# Altium project CW308T_SPC5676R.PrjPcb
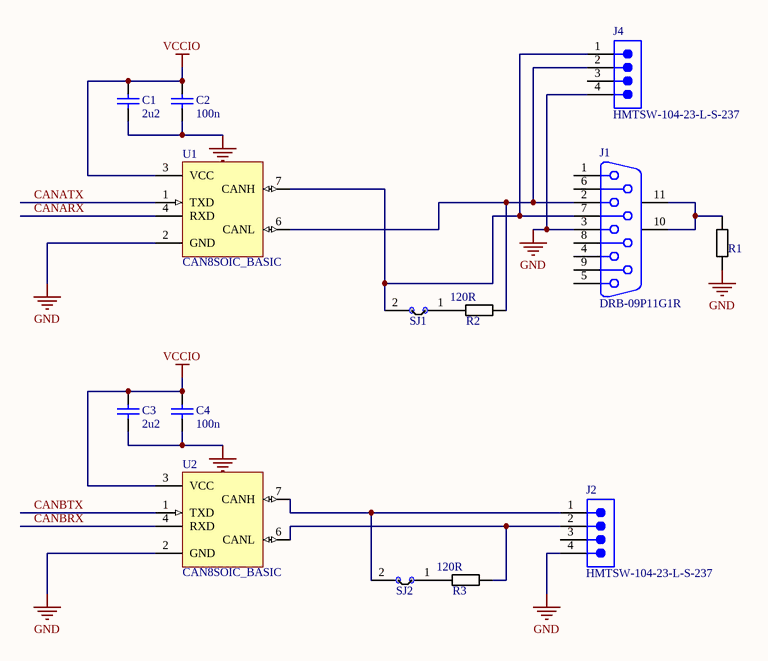
[diagram p0: mpc56_can.SchDoc]
PrjLicense: GPL; PrjName: CW308T-MPC5Y; PrjRev: 03
5 sheets, 83 parts. Net scope: global (net labels, ports and power ports of the same name join across sheets).
Board file: CW308T_SPC56.PcbDoc
Sheets:
  mpc56_can.SchDoc
  mpc56_clk.SchDoc
  mpc56_cpuio2.SchDoc
  mpc56_cwconn.SchDoc
  mpc56_mcupower.SchDoc

## Sheet mpc56_can.SchDoc: CAN Transceivers
size Letter; Organization: NewAE Technology Inc.; Address1: 1083 Queen St., Suite 196; Address2: Halifax; Address3: NS; Address4: Canada B3H 0B2; SheetNumber: 1; SheetTotal: 5; SheetApproved: YES

### Parts
C1  2u2  [CAPC0603_M]
C2  100n  [CAPC0402_M]
C3  2u2  [CAPC0603_M]
C4  100n  [CAPC0402_M]
J1  DRB-09P11G1R  [TAIT-DRB-09P11G1R_V]
J2  HMTSW-104-23-L-S-237  [SMTC-HMTSW-104-23-X-S-237]
J4  HMTSW-104-23-L-S-237  [SMTC-HMTSW-104-23-X-S-237]
R1  10R  [RESC1608X55N]  (value not drawn)
R2  120R  [RESC1608X55N]
R3  120R  [RESC1608X55N]
SJ1  NC  [SJ_2S_NC]  (value not drawn)  (no BOM)
SJ2  NC  [SJ_2S_NC]  (value not drawn)  (no BOM)
U1  CAN8SOIC_BASIC  [SOIC8_NARROW]
U2  CAN8SOIC_BASIC  [SOIC8_NARROW]

### Nets
GND: C1.2 C2.2 C3.2 C4.2 J1.3 J2.4 J4.4 R1.1 U1.2(GND) U2.2(GND)
VCCIO: C1.1 C2.1 C3.1 C4.1 U1.3(VCC) U2.3(VCC)
CANARX: U1.4(RXD)
CANATX: U1.1(TXD)
CANBRX: U2.4(RXD)
CANBTX: U2.1(TXD)
NetJ1_2: J1.2 J4.2 R2.2 U1.6(CANL)
NetJ1_7: J1.7 J4.1 SJ1.2 U1.7(CANH)
NetJ1_10: J1.10(MH1) J1.11(MH2) R1.2
NetJ2_1: J2.1 SJ2.2 U2.7(CANH)
NetJ2_2: J2.2 R3.2 U2.6(CANL)
NetR2_1: R2.1 SJ1.1
NetR3_1: R3.1 SJ2.1

Not connected (* = marked no-connect by the designer): J1 1 4 5 6 8 9; J2 3; J4 3

### Notes on the sheet
- Title:
- Date:
- Rev:
- Time:
- Project:
- Sheet
- of
- License:
- Copyright © NewAE Technology Inc.
- Approved:
- NewAE.com
- File:

### Library data of the parts
C1 C3 = CCHIP-2u2-0603: 2u2, 0603; Case-EIA: 0603; Case-Metric: 1608; Part Number: CCHIP-2u2-0603; Component Kind: Standard; Component Type: Standard; Footprint: 0603; Pin Count: 2; Value: 2u2; Mounting Technology: SMT
C2 C4 = CCHIP-100n-0402: 100n, 0402; Case-EIA: 0402; Part Number: CCHIP-100n-0402; Component Kind: Standard; Component Type: Standard; Footprint: 0402; Pin Count: 2; Value: 100n; Mounting Technology: SMT
J1 = CMP-0264-00001-1: DB9 R/A Connector, Through-hole, Male; ComponentLink1URL: http://www.taitek.com/; ComponentLink2URL: http://www.taitek.com/connects_prod_info.asp?id=A100011; PartNumber: DRB-09P11G1R; PackageDescription: 9-Pin D-Sub R/A  Male Connector, 2.77 mm Pitch; ComponentLink2Description: Datasheet; Mounting Technology: Through Hole; PackageReference: DRB-09P11G1R; ComponentLink1Description: Manufacturer URL
J2 J4 = CMP-1024-00020-1: Manufacturer: Samtec; Pitch: 2.54 mm; ComponentLink3URL: http://www.samtec.com/documents/webfiles/cpdf/HMTSW-XXX-XX-X-X-XXXX-XX-XX-MKT1.pdf; PartNumber: HMTSW-104-23-L-S-237; Temperature Range: -55 to 125 degC; ComponentLink1Description: Manufacturer URL; Orientation: Vertical; ComponentLink3Description: Package Specification; ComponentLink2URL: http://www.samtec.com/documents/webfiles/pdf/HMTSW.PDF; DatasheetVersion: F-214; PackageDescription: Assembly .025 [.64] SQ. Post Hi-Temp Terminal Strip; ComponentLink1URL: http://www.samtec.com; PackageReference: HMTSW-104-23-X-S-237; RoHS: True; Mounting Technology: Through-hole; ComponentLink2Description: Datasheet; PackageVersion: AL, 3/1987
R1 = RCHIP-10R-0603: 10R res, 0603, 1%, 1/10W; Manufacture 1: Yageo; Manufacture Part Number 1: RC0603FR-0710RL; Case-EIA: 0603; Case-Metric: 1608; Rated Power: 0.1W; Rated Voltage: 75VDC; Part Number: RCHIP-10R-0603; Component Kind: Standard; Component Type: Standard; Footprint: 0603; Pin Count: 2; Supplier 1: Digi-Key; Supplier Part Number 1: 311-10.0HRCT-ND; Value: 10R; Tolerance: 1%; Mounting Technology: SMT; Temperature Range: -55C to 155C
R2 R3 = RCHIP-120R-0603: 120R res, 0603, 1%, 1/10W; Manufacture 1: Yageo; Manufacture Part Number 1: RC0603FR-07120RL; Case-EIA: 0603; Case-Metric: 1608; Rated Power: 0.1W; Rated Voltage: 75VDC; Part Number: RCHIP-120R-0603; Component Kind: Standard; Component Type: Standard; Footprint: 0603; Pin Count: 2; Supplier 1: Digi-Key; Supplier Part Number 1: 311-120HRCT-ND; Value: 120R; Tolerance: 1%; Mounting Technology: SMT; Temperature Range: -55C to 155C
SJ1 SJ2 = SJ_2S: Solder Jumper, NC; Part Number: SJ_2S; Component Type: Standard (No BOM); Pin Count: 2
U1 U2 = SN65HVD232DR: CAN Transceiver, 3.3V; Manufacture 1: Texas Instruments; Component Group: Digital IC; Part Number: SN65HVD232DR; Footprint: SOIC8; Manufacture Part Number 1: SN65HVD232DR; Pin Count: 8; Supplier 1: Digi-Key; Supplier Part Number 1: 296-26344-1-ND; Mounting Technology: SMT; RoHS: Yes; Component Kind: Standard; Component Type: Standard

## Sheet mpc56_clk.SchDoc: Clock/Reset Drivers
size Letter; Organization: NewAE Technology Inc.; Address1: 1083 Queen St., Suite 196; Address2: Halifax; Address3: NS; Address4: Canada B3H 0B2; SheetNumber: 2; SheetTotal: 5; SheetApproved: YES
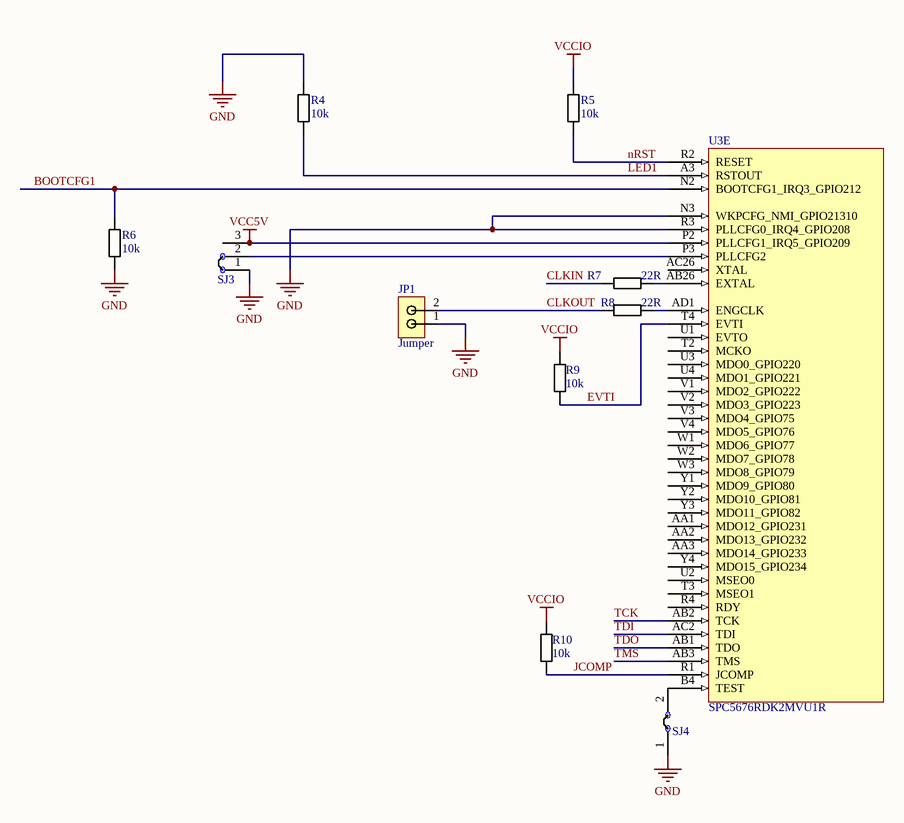
[diagram p1: mpc56_clk.SchDoc]

### Parts
JP1  Jumper  [2x2.54mm_Header]
R4  10k  [RESC1608X55N]
R5  10k  [RESC1608X55N]
R6  10k  [RESC1608X55N]
R7  22R  [RESC1608X55N]
R8  22R  [RESC1608X55N]
R9  10k  [RESC1608X55N]
R10  10k  [RESC1608X55N]
SJ3  NC  [SJ_3S_NC12]  (value not drawn)  (no BOM)
SJ4  NC  [SJ_2S_NC]  (value not drawn)  (no BOM)
U3  SPC5676RDK2MVU1R  [TEPBGA416_27x27]  (part E of 6)

### Nets
GND: JP1.1 R4.1 R6.2 SJ3.1 SJ4.1 U3.N3(WKPCFG_NMI_GPIO21310) U3.R3(PLLCFG0_IRQ4_GPIO208)
VCC5V: SJ3.3 U3.P2(PLLCFG1_IRQ5_GPIO209)
VCCIO: R5.1 R9.2 R10.1
BOOTCFG1: R6.1 U3.N2(BOOTCFG1_IRQ3_GPIO212)
CLKIN: R7.2
CLKOUT: JP1.2 R8.2
EVTI: R9.1 U3.T4(EVTI)
JCOMP: R10.2 U3.R1(JCOMP)
LED1: R4.2 U3.A3(RSTOUT)
nRST: R5.2 U3.R2(RESET)
TCK: U3.AB2(TCK)
TDI: U3.AC2(TDI)
TDO: U3.AB1(TDO)
TMS: U3.AB3(TMS)
NetR7_1: R7.1 U3.AB26(EXTAL)
NetR8_1: R8.1 U3.AD1(ENGCLK)
NetSJ3_2: SJ3.2 U3.P3(PLLCFG2)
NetSJ4_2: SJ4.2 U3.B4(TEST)

Not connected (* = marked no-connect by the designer): U3 AA1(MDO12_GPIO231) AA2(MDO13_GPIO232) AA3(MDO14_GPIO233) AC26(XTAL) R4(RDY) T2(MCKO) T3(MSEO1) U1(EVTO) U2(MSEO0) U3(MDO0_GPIO220) U4(MDO1_GPIO221) V1(MDO2_GPIO222) V2(MDO3_GPIO223) V3(MDO4_GPIO75) V4(MDO5_GPIO76) W1(MDO6_GPIO77) W2(MDO7_GPIO78) W3(MDO8_GPIO79) Y1(MDO9_GPIO80) Y2(MDO10_GPIO81) Y3(MDO11_GPIO82) Y4(MDO15_GPIO234)

### Notes on the sheet
- Title:
- Date:
- Rev:
- Time:
- Project:
- Sheet
- of
- License:
- Copyright © NewAE Technology Inc.
- Approved:
- NewAE.com
- File:

### Library data of the parts
JP1 = 2_PIN_JUMPER: 1x2 2.54mm header, male pins; Manufacture 1: Harwin; Manufacture Part Number 1: M20-9990246; Component Group: PCB Feature; PP Material Stack: 0; Part Number: 2_PIN_JUMPER; Pin Count: 2; Supplier 1: Digi-Key; Supplier Part Number 1: 952-2262-ND; Mounting Technology: Through-hole; RoHS: Yes; Component Kind: Standard; Component Type: Standard; PP Rotation: 0
R4-R6 R9 R10 = RCHIP-10K-0603: 10k res, 0603, 1%, 1/10W; Manufacture 1: Yageo; Manufacture Part Number 1: RC0603FR-0710KL; Case-EIA: 0603; Case-Metric: 1608; Rated Power: 0.1W; Rated Voltage: 75VDC; Part Number: RCHIP-10K-0603; Component Kind: Standard; Component Type: Standard; Footprint: 0603; Pin Count: 2; Supplier 1: Digi-Key; Supplier Part Number 1: 311-10.0KHRCT-ND; Value: 10k; Tolerance: 1%; Mounting Technology: SMT; Temperature Range: -55C to 155C
R7 R8 = RCHIP-22R-0603: 22R res, 0603, 1%, 1/10W; Manufacture 1: Yageo; Manufacture Part Number 1: RC0603FR-0722RL; Case-EIA: 0603; Case-Metric: 1608; Rated Power: 0.1W; Rated Voltage: 75VDC; Part Number: RCHIP-22R-0603; Component Kind: Standard; Component Type: Standard; Footprint: 0603; Pin Count: 2; Supplier 1: Digi-Key; Supplier Part Number 1: 311-22.0HRCT-ND; Value: 22R; Tolerance: 1%; Mounting Technology: SMT; Temperature Range: -55C to 155C
SJ3 = SJ_3S_12JMP: Solder Jumper, NC; Component Group: PCB Feature; Part Number: SJ_3S_12JMP; Pin Count: 3; Mounting Technology: COPPER; Component Type: Standard (No BOM)
SJ4 = SJ_2S: Solder Jumper, NC; Part Number: SJ_2S; Component Type: Standard (No BOM); Pin Count: 2
U3 = SPC5676RDK2MVU1R: Dual-Core PPC, Automotive; Manufacture 1: NXP; Component Group: Digital IC; PP Material Stack: 0; Part Number: SPC5676RDK2MVU1R; Manufacture Part Number 1: SPC5676RDK2MVU1R; Pin Count: 412; Supplier 1: Mouser; Mounting Technology: SMT; RoHS: Yes; Component Kind: Standard; Component Type: Standard; PP Rotation: 0

## Sheet mpc56_cpuio2.SchDoc: CPU I/O Bank 2
size Letter; Organization: NewAE Technology Inc.; Address1: 1083 Queen St., Suite 196; Address2: Halifax; Address3: NS; Address4: Canada B3H 0B2; SheetNumber: 3; SheetTotal: 5; SheetApproved: NO
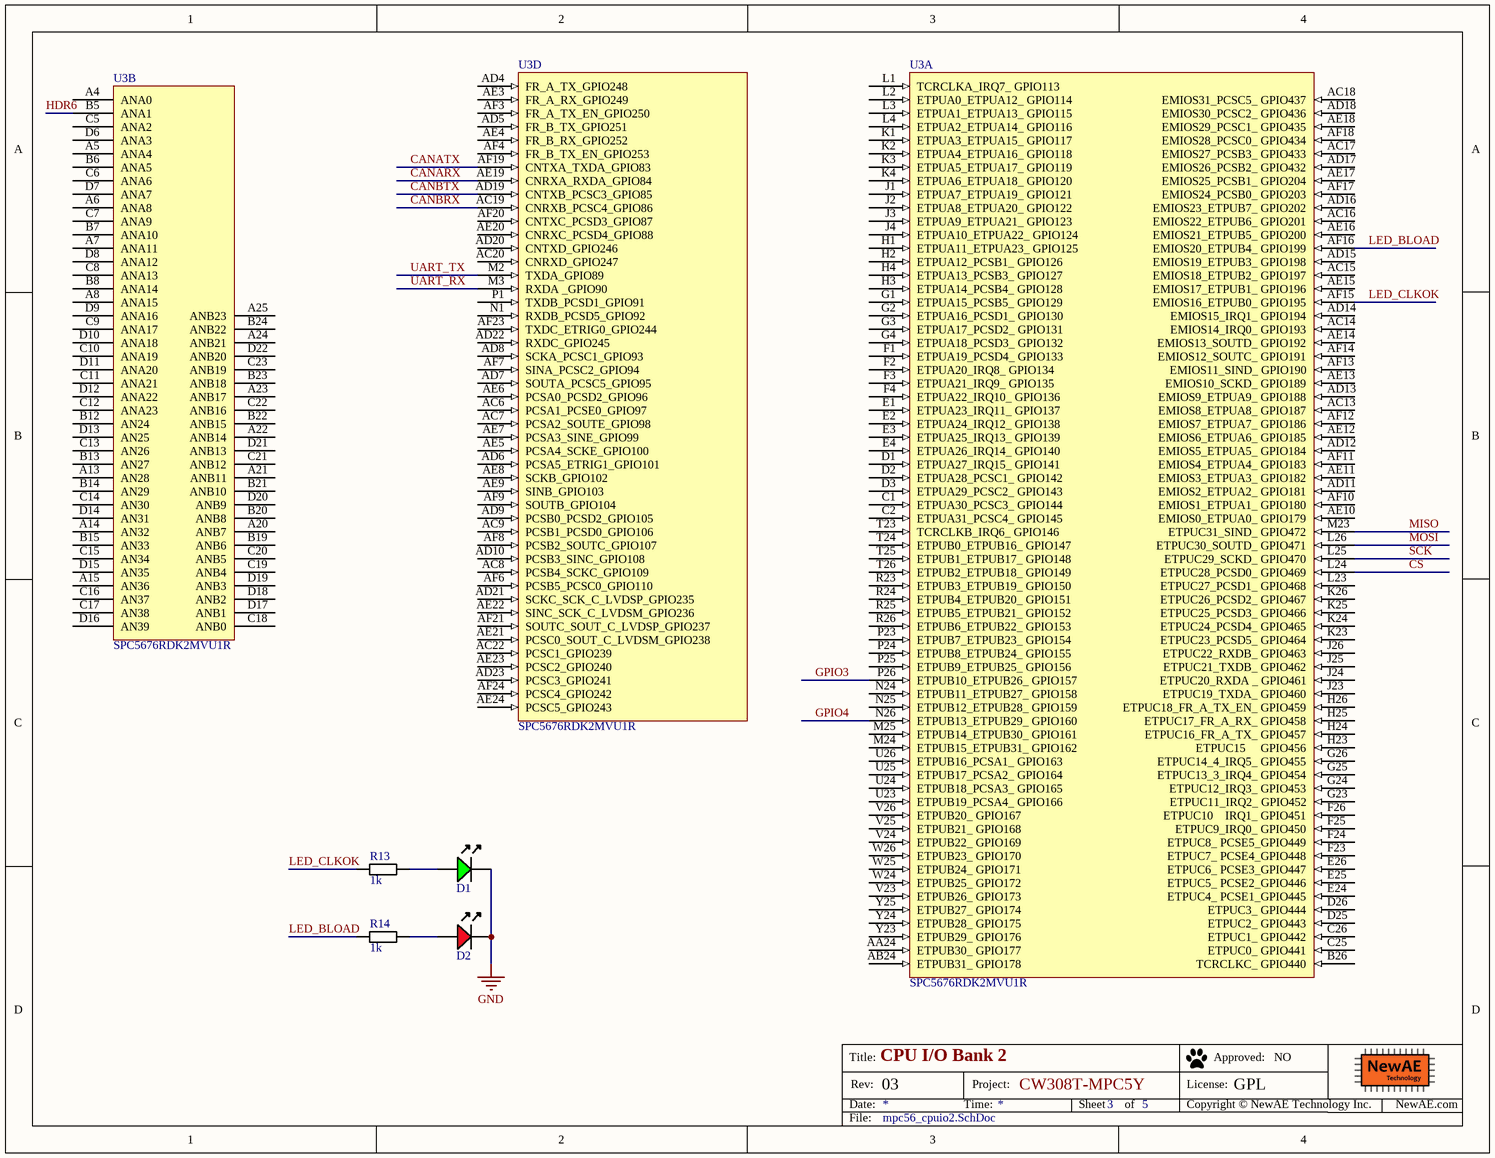
[diagram p2: mpc56_cpuio2.SchDoc]

### Parts
D1  LED, 0603, Green  [LED-0603-GREEN]  (value not drawn)
D2  LED, 0603, Red  [LED-0603-RED]  (value not drawn)
R13  1k  [RESC1608X55N]
R14  1k  [RESC1608X55N]
U3  SPC5676RDK2MVU1R  [TEPBGA416_27x27]  (parts A,B,D of 6)

### Nets
GND: D1.K D2.K
VCCIO: U3.AF4(FR_B_TX_EN_GPIO253)
CANARX: U3.AE19(CNRXA_RXDA_GPIO84)
CANATX: U3.AF19(CNTXA_TXDA_GPIO83)
CANBRX: U3.AC19(CNRXB_PCSC4_GPIO86)
CANBTX: U3.AD19(CNTXB_PCSC3_GPIO85)
CS: U3.L24(ETPUC28_PCSD0__GPIO469)
GPIO3: U3.P26(ETPUB10_ETPUB26__GPIO157)
GPIO4: U3.N26(ETPUB13_ETPUB29__GPIO160)
HDR6: U3.B5(ANA1)
LED_BLOAD: R14.1 U3.AF16(EMIOS20_ETPUB4__GPIO199)
LED_CLKOK: R13.1 U3.AF15(EMIOS16_ETPUB0__GPIO195)
MISO: U3.M23(ETPUC31_SIND__GPIO472)
MOSI: U3.L26(ETPUC30_SOUTD__GPIO471)
SCK: U3.L25(ETPUC29_SCKD__GPIO470)
UART_RX: U3.M3(RXDA__GPIO90)
UART_TX: U3.M2(TXDA_GPIO89)
NetD1_A: D1.A R13.2
NetD2_A: D2.A R14.2

Not connected (* = marked no-connect by the designer): U3 A4(ANA0) A5(ANA4) A6(ANA8) A7(ANA11) A8(ANA15) A13(AN28) A14(AN32) A15(AN36) A20(ANB7) A21(ANB11) A22(ANB14) A23(ANB17) A24(ANB21) A25(ANB23) AA24(ETPUB30__GPIO177) AB24(ETPUB31__GPIO178) AC6(PCSA1_PCSE0_GPIO97) AC7(PCSA2_SOUTE_GPIO98) AC8(PCSB4_SCKC_GPIO109) AC9(PCSB1_PCSD0_GPIO106) AC13(EMIOS8_ETPUA8__GPIO187) AC14(EMIOS14_IRQ0__GPIO193) AC15(EMIOS18_ETPUB2__GPIO197) AC16(EMIOS22_ETPUB6__GPIO201) AC17(EMIOS27_PCSB3__GPIO433) AC18(EMIOS31_PCSC5__GPIO437) AC20(CNRXD_GPIO247) AC22(PCSC1_GPIO239) AD4(FR_A_TX_GPIO248) AD5(FR_B_TX_GPIO251) AD6(PCSA5_ETRIG1_GPIO101) AD7(SOUTA_PCSC5_GPIO95) AD8(SCKA_PCSC1_GPIO93) AD9(PCSB0_PCSD2_GPIO105) AD10(PCSB3_SINC_GPIO108) AD11(EMIOS2_ETPUA2__GPIO181) AD12(EMIOS5_ETPUA5__GPIO184) AD13(EMIOS9_ETPUA9__GPIO188) AD14(EMIOS15_IRQ1__GPIO194) AD15(EMIOS19_ETPUB3__GPIO198) AD16(EMIOS23_ETPUB7__GPIO202) AD17(EMIOS26_PCSB2__GPIO432) AD18(EMIOS30_PCSC2__GPIO436) AD20(CNTXD_GPIO246) AD21(SCKC_SCK_C_LVDSP_GPIO235) AD22(RXDC_GPIO245) AD23(PCSC3_GPIO241) AE3(FR_A_RX_GPIO249) AE4(FR_B_RX_GPIO252) AE5(PCSA4_SCKE_GPIO100) AE6(PCSA0_PCSD2_GPIO96) AE7(PCSA3_SINE_GPIO99) AE8(SCKB_GPIO102) AE9(SINB_GPIO103) AE10(EMIOS0_ETPUA0__GPIO179) AE11(EMIOS3_ETPUA3__GPIO182) AE12(EMIOS6_ETPUA6__GPIO185) AE13(EMIOS10_SCKD__GPIO189) AE14(EMIOS13_SOUTD__GPIO192) AE15(EMIOS17_ETPUB1__GPIO196) AE16(EMIOS21_ETPUB5__GPIO200) AE17(EMIOS25_PCSB1__GPIO204) AE18(EMIOS29_PCSC1__GPIO435) AE20(CNRXC_PCSD4_GPIO88) AE21(PCSC0_SOUT_C_LVDSM_GPIO238) AE22(SINC_SCK_C_LVDSM_GPIO236) AE23(PCSC2_GPIO240) AE24(PCSC5_GPIO243) AF3(FR_A_TX_EN_GPIO250) AF6(PCSB5_PCSC0_GPIO110) AF7(SINA_PCSC2_GPIO94) AF8(PCSB2_SOUTC_GPIO107) AF9(SOUTB_GPIO104) AF10(EMIOS1_ETPUA1__GPIO180) AF11(EMIOS4_ETPUA4__GPIO183) AF12(EMIOS7_ETPUA7__GPIO186) AF13(EMIOS11_SIND__GPIO190) AF14(EMIOS12_SOUTC__GPIO191) AF17(EMIOS24_PCSB0__GPIO203) AF18(EMIOS28_PCSC0__GPIO434) AF20(CNTXC_PCSD3_GPIO87) AF21(SOUTC_SOUT_C_LVDSP_GPIO237) AF23(TXDC_ETRIG0_GPIO244) AF24(PCSC4_GPIO242) B6(ANA5) B7(ANA10) B8(ANA14) B12(AN24) B13(AN27) B14(AN29) B15(AN33) B19(ANB6) B20(ANB8) B21(ANB10) B22(ANB15) B23(ANB18) B24(ANB22) B26(TCRCLKC__GPIO440) C1(ETPUA30_PCSC3__GPIO144) C2(ETPUA31_PCSC4__GPIO145) C5(ANA2) C6(ANA6) C7(ANA9) C8(ANA13) C9(ANA17) C10(ANA19) C11(ANA21) C12(ANA23) C13(AN26) C14(AN30) C15(AN34) C16(AN37) C17(AN38) C18(ANB0) C19(ANB4) C20(ANB5) C21(ANB12) C22(ANB16) C23(ANB19) C25(ETPUC0__GPIO441) C26(ETPUC1__GPIO442) D1(ETPUA27_IRQ15__GPIO141) D2(ETPUA28_PCSC1__GPIO142) D3(ETPUA29_PCSC2__GPIO143) D6(ANA3) D7(ANA7) D8(ANA12) D9(ANA16) D10(ANA18) D11(ANA20) D12(ANA22) D13(AN25) D14(AN31) D15(AN35) D16(AN39) D17(ANB1) D18(ANB2) D19(ANB3) D20(ANB9) D21(ANB13) D22(ANB20) D25(ETPUC2__GPIO443) D26(ETPUC3__GPIO444) E1(ETPUA23_IRQ11__GPIO137) E2(ETPUA24_IRQ12__GPIO138) E3(ETPUA25_IRQ13__GPIO139) E4(ETPUA26_IRQ14__GPIO140) E24(ETPUC4__PCSE1_GPIO445) E25(ETPUC5__PCSE2_GPIO446) E26(ETPUC6__PCSE3_GPIO447) F1(ETPUA19_PCSD4__GPIO133) F2(ETPUA20_IRQ8__GPIO134) F3(ETPUA21_IRQ9__GPIO135) F4(ETPUA22_IRQ10__GPIO136) F23(ETPUC7__PCSE4_GPIO448) F24(ETPUC8__PCSE5_GPIO449) F25(ETPUC9_IRQ0__GPIO450) F26(ETPUC10    IRQ1__GPIO451) G1(ETPUA15_PCSB5__GPIO129) G2(ETPUA16_PCSD1__GPIO130) G3(ETPUA17_PCSD2__GPIO131) G4(ETPUA18_PCSD3__GPIO132) G23(ETPUC11_IRQ2__GPIO452) G24(ETPUC12_IRQ3__GPIO453) G25(ETPUC13_3_IRQ4__GPIO454) G26(ETPUC14_4_IRQ5__GPIO455) H1(ETPUA11_ETPUA23__GPIO125) H2(ETPUA12_PCSB1__GPIO126) H3(ETPUA14_PCSB4__GPIO128) H4(ETPUA13_PCSB3__GPIO127) H23(ETPUC15    _GPIO456) H24(ETPUC16_FR_A_TX__GPIO457) H25(ETPUC17_FR_A_RX__GPIO458) H26(ETPUC18_FR_A_TX_EN__GPIO459) J1(ETPUA7_ETPUA19__GPIO121) J2(ETPUA8_ETPUA20__GPIO122) J3(ETPUA9_ETPUA21__GPIO123) J4(ETPUA10_ETPUA22__GPIO124) J23(ETPUC19_TXDA__GPIO460) J24(ETPUC20_RXDA___GPIO461) J25(ETPUC21_TXDB__GPIO462) J26(ETPUC22_RXDB__GPIO463) K1(ETPUA3_ETPUA15__GPIO117) K2(ETPUA4_ETPUA16__GPIO118) K3(ETPUA5_ETPUA17__GPIO119) K4(ETPUA6_ETPUA18__GPIO120) K23(ETPUC23_PCSD5__GPIO464) K24(ETPUC24_PCSD4__GPIO465) K25(ETPUC25_PCSD3__GPIO466) K26(ETPUC26_PCSD2__GPIO467) L1(TCRCLKA_IRQ7__GPIO113) L2(ETPUA0_ETPUA12__GPIO114) L3(ETPUA1_ETPUA13__GPIO115) L4(ETPUA2_ETPUA14__GPIO116) L23(ETPUC27_PCSD1__GPIO468) M24(ETPUB15_ETPUB31__GPIO162) M25(ETPUB14_ETPUB30__GPIO161) N1(RXDB_PCSD5_GPIO92) N24(ETPUB11_ETPUB27__GPIO158) N25(ETPUB12_ETPUB28__GPIO159) P1(TXDB_PCSD1_GPIO91) P23(ETPUB7_ETPUB23__GPIO154) P24(ETPUB8_ETPUB24__GPIO155) P25(ETPUB9_ETPUB25__GPIO156) R23(ETPUB3_ETPUB19__GPIO150) R24(ETPUB4_ETPUB20__GPIO151) R25(ETPUB5_ETPUB21__GPIO152) R26(ETPUB6_ETPUB22__GPIO153) T23(TCRCLKB_IRQ6__GPIO146) T24(ETPUB0_ETPUB16__GPIO147) T25(ETPUB1_ETPUB17__GPIO148) T26(ETPUB2_ETPUB18__GPIO149) U23(ETPUB19_PCSA4__GPIO166) U24(ETPUB18_PCSA3__GPIO165) U25(ETPUB17_PCSA2__GPIO164) U26(ETPUB16_PCSA1__GPIO163) V23(ETPUB26__GPIO173) V24(ETPUB22__GPIO169) V25(ETPUB21__GPIO168) V26(ETPUB20__GPIO167) W24(ETPUB25__GPIO172) W25(ETPUB24__GPIO171) W26(ETPUB23__GPIO170) Y23(ETPUB29__GPIO176) Y24(ETPUB28__GPIO175) Y25(ETPUB27__GPIO174)

### Notes on the sheet
- Title:
- Date:
- Rev:
- Time:
- Project:
- Sheet
- of
- License:
- Copyright © NewAE Technology Inc.
- Approved:
- NewAE.com
- File:

### Library data of the parts
D1 = LEDCHIP_0603_GREEN: Chip LED, Green; Part Number: LEDCHIP_0603_GREEN; Component Kind: Standard; Component Type: Standard; Pin Count: 2; Mounting Technology: SMT
D2 = LEDCHIP_0603_RED: Chip LED, Red; Part Number: LEDCHIP_0603_RED; Component Kind: Standard; Component Type: Standard; Pin Count: 2; Mounting Technology: SMT
R13 R14 = RCHIP-1K-0603: 1k res, 0603, 1%, 1/10W; Manufacture 1: Yageo; Manufacture Part Number 1: RC0603FR-071KL; Case-EIA: 0603; Case-Metric: 1608; Rated Power: 0.1W; Rated Voltage: 75VDC; Part Number: RCHIP-1K-0603; Component Kind: Standard; Component Type: Standard; Footprint: 0603; Pin Count: 2; Supplier 1: Digi-Key; Supplier Part Number 1: 311-1.00KHRCT-ND; Value: 1k; Tolerance: 1%; Mounting Technology: SMT; Temperature Range: -55C to 155C
U3 = SPC5676RDK2MVU1R: as U3 on sheet mpc56_clk; Part Number: SPC5676RDK2MVU1R; Manufacture Part Number 1: SPC5676RDK2MVU1R; Pin Count: 412; Supplier 1: Mouser; Mounting Technology: SMT; RoHS: Yes; Component Kind: Standard; Component Type: Standard; PP Rotation: 0

## Sheet mpc56_cwconn.SchDoc: CW308 UFO Connectors
size Letter; Organization: NewAE Technology Inc.; Address1: 1083 Queen St., Suite 196; Address2: Halifax; Address3: NS; Address4: Canada B3H 0B2; SheetNumber: 4; SheetTotal: 5; SheetApproved: YES
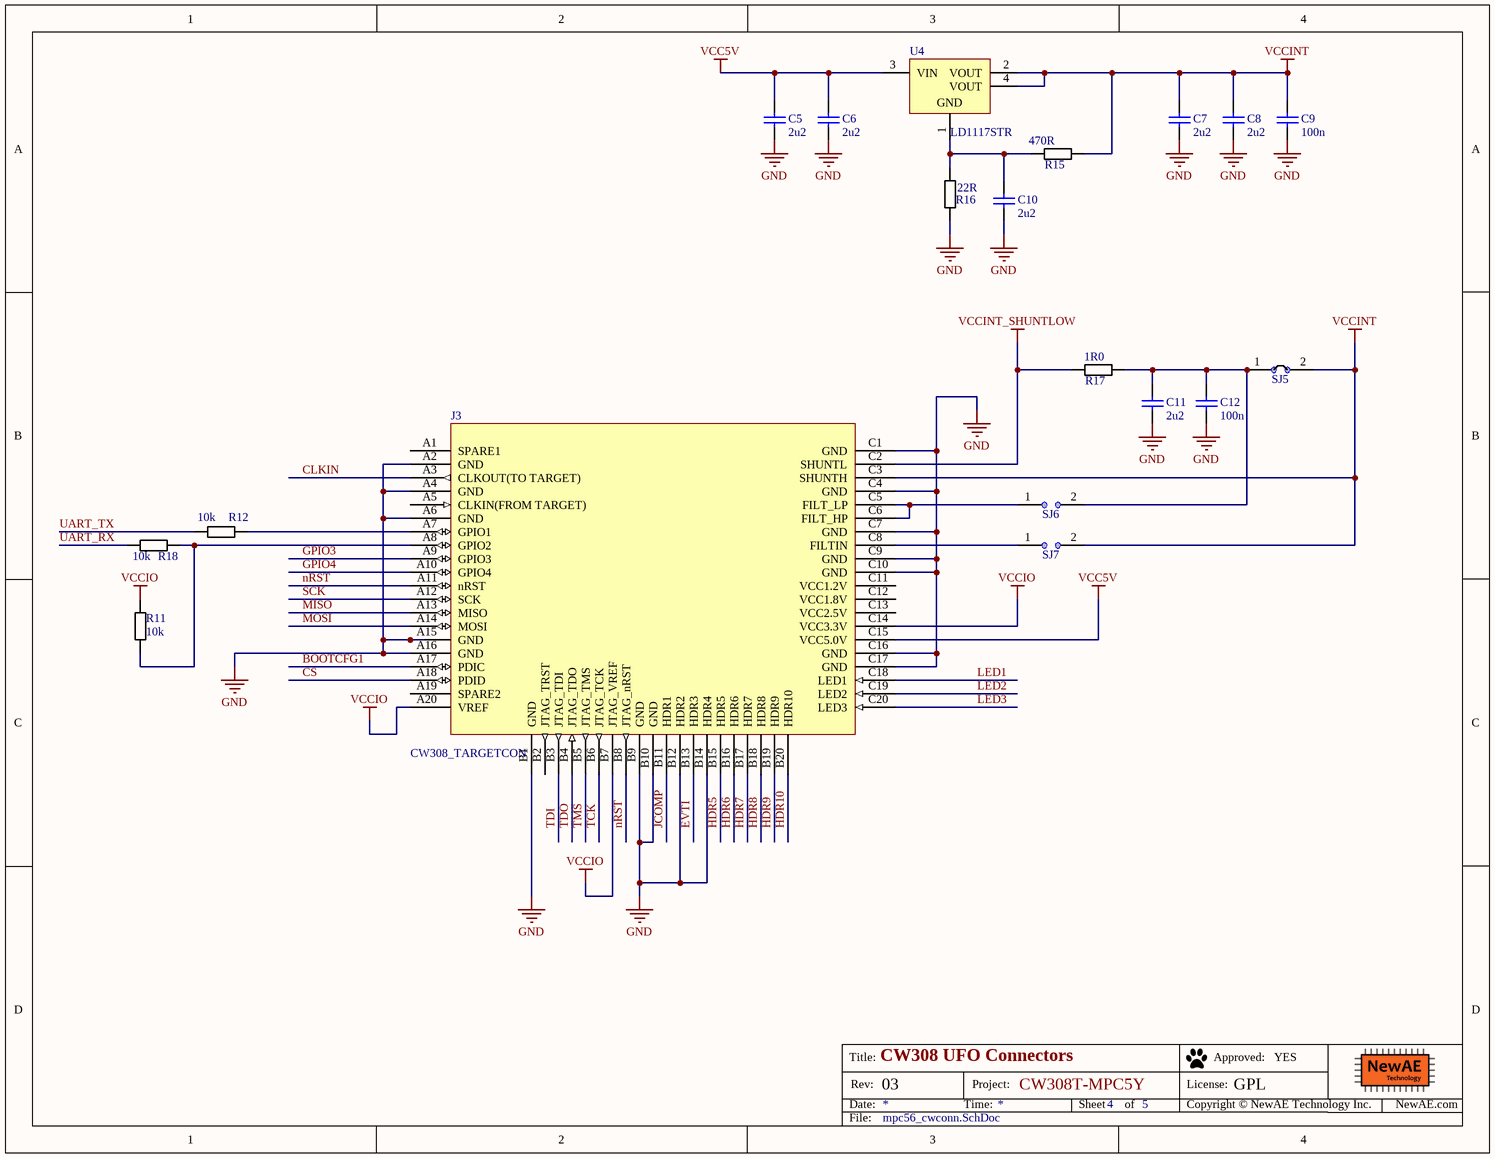
[diagram p3: mpc56_cwconn.SchDoc]

### Parts
C5  2u2  [CAPC0603_M]
C6  2u2  [CAPC0603_M]
C7  2u2  [CAPC0603_M]
C8  2u2  [CAPC0603_M]
C9  100n  [CAPC0402_M]
C10  2u2  [CAPC0603_M]
C11  2u2  [CAPC0603_M]
C12  100n  [CAPC0402_M]
J3  CW308_TARGETCON  [CW308_TBOARD_CONN]
R11  10k  [RESC1608X55N]
R12  10k  [RESC1608X55N]
R15  470R  [RESC1608X55N]
R16  22R  [RESC1608X55N]
R17  1R0  [RESC2012X70N]
R18  10k  [RESC1608X55N]
SJ5  NC  [SJ_2S_NC]  (value not drawn)  (no BOM)
SJ6  NO  [SJ_2S_NO]  (value not drawn)  (no BOM)
SJ7  NO  [SJ_2S_NO]  (value not drawn)  (no BOM)
U4  LD1117STR  [SOT-223_L]

### Nets
GND: C5.2 C6.2 C7.2 C8.2 C9.2 C10.2 C11.2 C12.2 J3.A2(GND) J3.A4(GND) J3.A6(GND) J3.A15(GND) J3.A16(GND) J3.B1(GND) J3.B9(GND) J3.B10(GND) J3.B12(HDR2) J3.B14(HDR4) J3.C1(GND) J3.C4(GND) J3.C7(GND) J3.C9(GND) J3.C10(GND) J3.C16(GND) J3.C17(GND) R16.2
VCC5V: C5.1 C6.1 J3.C15(VCC5.0V) U4.3(VIN)
VCCINT: C7.1 C8.1 C9.1 J3.C3(SHUNTH) R15.1 SJ5.2 SJ7.2 U4.2(VOUT) U4.4(VOUT)
VCCINT_SHUNTLOW: J3.C2(SHUNTL) R17.1
VCCIO: J3.A20(VREF) J3.B7(JTAG_VREF) J3.C14(VCC3.3V) R11.2
BOOTCFG1: J3.A17(PDIC)
CLKIN: J3.A3(CLKOUT(TO_TARGET))
CS: J3.A18(PDID)
EVTI: J3.B13(HDR3)
GPIO3: J3.A9(GPIO3)
GPIO4: J3.A10(GPIO4)
HDR5: J3.B15(HDR5)
HDR6: J3.B16(HDR6)
HDR7: J3.B17(HDR7)
HDR8: J3.B18(HDR8)
HDR9: J3.B19(HDR9)
HDR10: J3.B20(HDR10)
JCOMP: J3.B11(HDR1)
LED1: J3.C18(LED1)
LED2: J3.C19(LED2)
LED3: J3.C20(LED3)
MISO: J3.A13(MISO)
MOSI: J3.A14(MOSI)
nRST: J3.A11(nRST) J3.B8(JTAG_nRST)
SCK: J3.A12(SCK)
TCK: J3.B6(JTAG_TCK)
TDI: J3.B3(JTAG_TDI)
TDO: J3.B4(JTAG_TDO)
TMS: J3.B5(JTAG_TMS)
UART_RX: R18.1
UART_TX: R12.1
NetC10_1: C10.1 R15.2 R16.1 U4.1(GND)
NetC11_1: C11.1 C12.1 R17.2 SJ5.1 SJ6.2
NetJ3_A7: J3.A7(GPIO1) R12.2
NetJ3_A8: J3.A8(GPIO2) R11.1 R18.2
NetJ3_C5: J3.C5(FILT_LP) J3.C6(FILT_HP) SJ6.1
NetJ3_C8: J3.C8(FILTIN) SJ7.1

Not connected (* = marked no-connect by the designer): J3 A1(SPARE1) A5(CLKIN(FROM_TARGET)) A19(SPARE2) B2(JTAG_TRST) C11(VCC1.2V) C12(VCC1.8V) C13(VCC2.5V)

### Notes on the sheet
- Title:
- Date:
- Rev:
- Time:
- Project:
- Sheet
- of
- License:
- Copyright © NewAE Technology Inc.
- Approved:
- NewAE.com
- File:

### Library data of the parts
C5-C8 C10 C11 = CCHIP-2u2-0603: as C1 on sheet mpc56_can; Part Number: CCHIP-2u2-0603; Component Kind: Standard; Component Type: Standard; Footprint: 0603; Pin Count: 2; Value: 2u2; Mounting Technology: SMT
C9 C12 = CCHIP-100n-0402: 100n, 0402; Case-EIA: 0402; Part Number: CCHIP-100n-0402; Component Kind: Standard; Component Type: Standard; Footprint: 0402; Pin Count: 2; Value: 100n; Mounting Technology: SMT
J3 = CW308_TBOARD: CW308 "Standard" Target Board Connector
R11 R12 R18 = RCHIP-10K-0603: as R4 on sheet mpc56_clk; Part Number: RCHIP-10K-0603; Component Kind: Standard; Component Type: Standard; Footprint: 0603; Pin Count: 2; Supplier 1: Digi-Key; Supplier Part Number 1: 311-10.0KHRCT-ND; Value: 10k; Tolerance: 1%; Mounting Technology: SMT; Temperature Range: -55C to 155C
R15 = RCHIP-120R-0603: 470R res, 0603, 1%, 1/10W; Manufacture 1: Yageo; Manufacture Part Number 1: RC0603FR-07470RL; Case-EIA: 0603; Case-Metric: 1608; Rated Power: 0.1W; Rated Voltage: 75VDC; Part Number: RCHIP-120R-0603; Component Kind: Standard; Component Type: Standard; Footprint: 0603; Pin Count: 2; Supplier 1: Digi-Key; Supplier Part Number 1: 311-470HRCT-ND; Value: 470R; Tolerance: 1%; Mounting Technology: SMT; Temperature Range: -55C to 155C
R16 = RCHIP-120R-0603: 120R res, 0603, 1%, 1/10W; Manufacture 1: Yageo; Manufacture Part Number 1: RC0603FR-0722RL; Case-EIA: 0603; Case-Metric: 1608; Rated Power: 0.1W; Rated Voltage: 75VDC; Part Number: RCHIP-120R-0603; Component Kind: Standard; Component Type: Standard; Footprint: 0603; Pin Count: 2; Supplier 1: Digi-Key; Supplier Part Number 1: 311-22HRCT-ND; Value: 22R; Tolerance: 1%; Mounting Technology: SMT; Temperature Range: -55C to 155C
R17 = RCHIP-1R0-0805: 1R0 res, 0805, 1%, 1/8W; Manufacture 1: Yageo; Manufacture Part Number 1: RC0805FR-071RL; Case-EIA: 0805; Rated Power: 0.125W; Rated Voltage: 75VDC; Part Number: RCHIP-1R0-0805; Component Kind: Standard; Component Type: Standard; Footprint: 0805; Pin Count: 2; Supplier 1: Digi-Key; Supplier Part Number 1: 311-1.00CRCT-ND; Value: 1R0; Tolerance: 1%; Mounting Technology: SMT; Temperature Range: -55C to 155C
SJ5 = SJ_2S: Solder Jumper, NC; Part Number: SJ_2S; Component Type: Standard (No BOM); Pin Count: 2
SJ6 SJ7 = SJ_2S_NO: Solder Jumper, NO; Part Number: SJ_2S_NO; Component Type: Standard (No BOM); Pin Count: 2; Mounting Technology: COPPER
U4 = CMP-0244-00313-1: Adjustable Low Drop Voltage Regulator, 1.25 to 15V, 4-Pin SOT-223, Tape and Reel; ComponentLink2Description: Datasheet; PackageVersion: 2010; PackageReference: SOT-223; ComponentLink2URL: http://www.st.com/internet/com/TECHNICAL_RESOURCES/TECHNICAL_LITERATURE/DATASHEET/CD00000544.pdf; DatasheetVersion: 1/11/2011; ComponentLink1URL: http://www.st.com; PackageDescription: 4-Pin SOT-223 Package, 6.5 x 3.5 mm Body, 2.3 mm Pitch, 7 mm Lead Span; ComponentLink1Description: Manufacturer URL; Supplier 1: Digi-Key; Supplier Part Number 1: 497-1244-1-ND

## Sheet mpc56_mcupower.SchDoc: MCU Power
size Letter; Organization: NewAE Technology Inc.; Address1: 1083 Queen St., Suite 196; Address2: Halifax; Address3: NS; Address4: Canada B3H 0B2; SheetNumber: 5; SheetTotal: 5; SheetApproved: YES
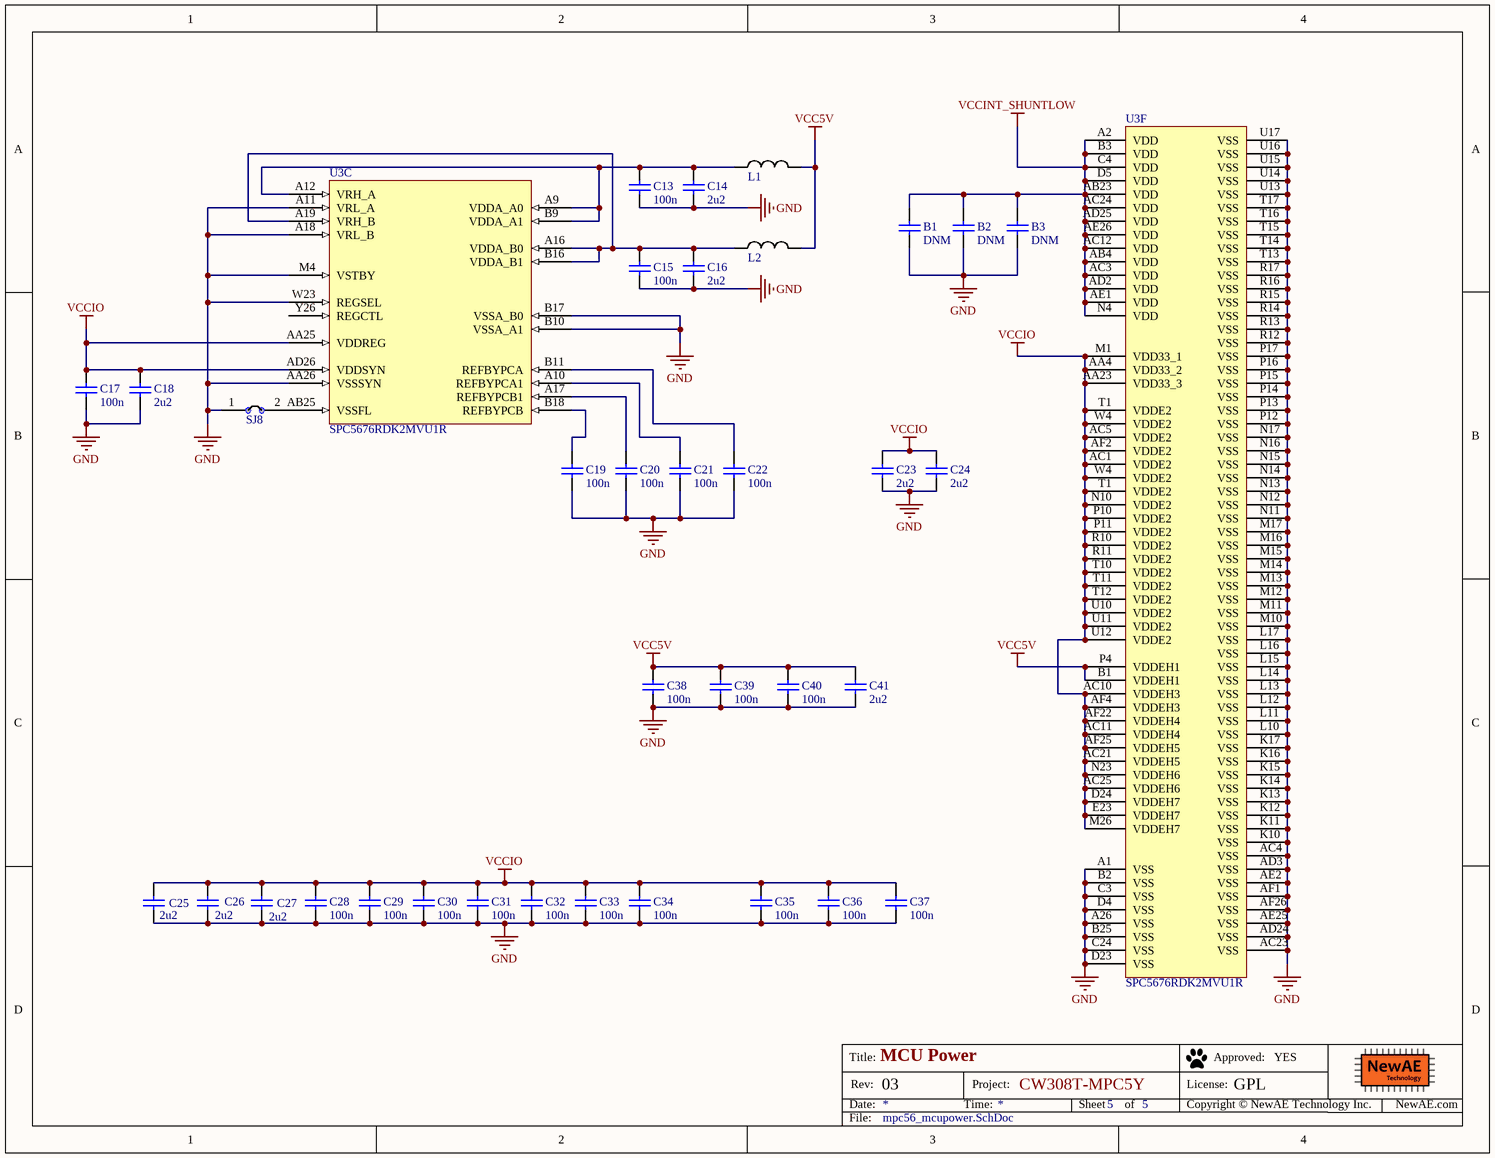
[diagram p4: mpc56_mcupower.SchDoc]

### Parts
B1  DNM  [CAPC0402_M]
B2  DNM  [CAPC0402_M]
B3  DNM  [CAPC0402_M]
C13  100n  [CAPC0402_M]
C14  2u2  [CAPC0603_M]
C15  100n  [CAPC0402_M]
C16  2u2  [CAPC0603_M]
C17  100n  [CAPC0402_M]
C18  2u2  [CAPC0603_M]
C19  100n  [CAPC0402_M]
C20  100n  [CAPC0402_M]
C21  100n  [CAPC0402_M]
C22  100n  [CAPC0402_M]
C23  2u2  [CAPC0603_M]
C24  2u2  [CAPC0603_M]
C25  2u2  [CAPC0603_M]
C26  2u2  [CAPC0603_M]
C27  2u2  [CAPC0603_M]
C28  100n  [CAPC0402_M]
C29  100n  [CAPC0402_M]
C30  100n  [CAPC0402_M]
C31  100n  [CAPC0402_M]
C32  100n  [CAPC0402_M]
C33  100n  [CAPC0402_M]
C34  100n  [CAPC0402_M]
C35  100n  [CAPC0402_M]
C36  100n  [CAPC0402_M]
C37  100n  [CAPC0402_M]
C38  100n  [CAPC0402_M]
C39  100n  [CAPC0402_M]
C40  100n  [CAPC0402_M]
C41  2u2  [CAPC0603_M]
L1  1k @ 1Mhz  [IND_0603]  (value not drawn)
L2  1k @ 1Mhz  [IND_0603]  (value not drawn)
SJ8  NC  [SJ_2S_NC]  (value not drawn)  (no BOM)
U3  SPC5676RDK2MVU1R  [TEPBGA416_27x27]  (parts C,F of 6)

### Nets
GND: B1.2 B2.2 B3.2 C13.2 C14.2 C15.2 C16.2 C17.2 C18.2 C19.2 C20.2 C21.2 C22.2 C23.2 C24.2 C25.2 C26.2 C27.2 C28.2 C29.2 C30.2 C31.2 C32.2 C33.2 C34.2 C35.2 C36.2 C37.2 C38.2 C39.2 C40.2 C41.2 SJ8.1 U3.A1(VSS) U3.A11(VRL_A) U3.A18(VRL_B) U3.A26(VSS) U3.AA26(VSSSYN) U3.AC4(VSS) U3.AC23(VSS) U3.AD3(VSS) U3.AD24(VSS) U3.AE2(VSS) U3.AE25(VSS) U3.AF1(VSS) U3.AF26(VSS) U3.B2(VSS) U3.B10(VSSA_A1) U3.B17(VSSA_B0) U3.B25(VSS) U3.C3(VSS) U3.C24(VSS) U3.D4(VSS) U3.D23(VSS) U3.K10(VSS) U3.K11(VSS) U3.K12(VSS) U3.K13(VSS) U3.K14(VSS) U3.K15(VSS) U3.K16(VSS) U3.K17(VSS) U3.L10(VSS) U3.L11(VSS) U3.L12(VSS) U3.L13(VSS) U3.L14(VSS) U3.L15(VSS) U3.L16(VSS) U3.L17(VSS) U3.M4(VSTBY) U3.M10(VSS) U3.M11(VSS) U3.M12(VSS) U3.M13(VSS) U3.M14(VSS) U3.M15(VSS) U3.M16(VSS) U3.M17(VSS) U3.N11(VSS) U3.N12(VSS) U3.N13(VSS) U3.N14(VSS) U3.N15(VSS) U3.N16(VSS) U3.N17(VSS) U3.P12(VSS) U3.P13(VSS) U3.P14(VSS) U3.P15(VSS) U3.P16(VSS) U3.P17(VSS) U3.R12(VSS) U3.R13(VSS) U3.R14(VSS) U3.R15(VSS) U3.R16(VSS) U3.R17(VSS) U3.T13(VSS) U3.T14(VSS) U3.T15(VSS) U3.T16(VSS) U3.T17(VSS) U3.U13(VSS) U3.U14(VSS) U3.U15(VSS) U3.U16(VSS) U3.U17(VSS) U3.W23(REGSEL)
VCC5V: C38.1 C39.1 C40.1 C41.1 L1.2 L2.2 U3.B1(VDDEH1) U3.P4(VDDEH1)
VCCINT_SHUNTLOW: B1.1 B2.1 B3.1 U3.A2(VDD) U3.AB4(VDD) U3.AB23(VDD) U3.AC3(VDD) U3.AC12(VDD) U3.AC24(VDD) U3.AD2(VDD) U3.AD25(VDD) U3.AE1(VDD) U3.AE26(VDD) U3.B3(VDD) U3.C4(VDD) U3.D5(VDD) U3.N4(VDD)
VCCIO: C17.1 C18.1 C23.1 C24.1 C25.1 C26.1 C27.1 C28.1 C29.1 C30.1 C31.1 C32.1 C33.1 C34.1 C35.1 C36.1 C37.1 U3.AA4(VDD33_2) U3.AA23(VDD33_3) U3.AA25(VDDREG) U3.AC1(VDDE2) U3.AC5(VDDE2) U3.AC10(VDDEH3) U3.AC11(VDDEH4) U3.AC21(VDDEH5) U3.AC25(VDDEH6) U3.AD26(VDDSYN) U3.AF2(VDDE2) U3.AF4(VDDEH3) U3.AF22(VDDEH4) U3.AF25(VDDEH5) U3.D24(VDDEH7) U3.E23(VDDEH7) U3.M1(VDD33_1) U3.M26(VDDEH7) U3.N10(VDDE2) U3.N23(VDDEH6) U3.P10(VDDE2) U3.P11(VDDE2) U3.R10(VDDE2) U3.R11(VDDE2) U3.T1(VDDE2) U3.T10(VDDE2) U3.T11(VDDE2) U3.T12(VDDE2) U3.U10(VDDE2) U3.U11(VDDE2) U3.U12(VDDE2) U3.W4(VDDE2)
NetC13_1: C13.1 C14.1 L1.1 U3.A9(VDDA_A0) U3.A12(VRH_A) U3.B9(VDDA_A1)
NetC15_1: C15.1 C16.1 L2.1 U3.A16(VDDA_B0) U3.A19(VRH_B) U3.B16(VDDA_B1)
NetC19_1: C19.1 U3.B18(REFBYPCB)
NetC20_1: C20.1 U3.A17(REFBYPCB1)
NetC21_1: C21.1 U3.A10(REFBYPCA1)
NetC22_1: C22.1 U3.B11(REFBYPCA)
NetSJ8_2: SJ8.2 U3.AB25(VSSFL)

Not connected (* = marked no-connect by the designer): U3 Y26(REGCTL)

### Notes on the sheet
- Title:
- Date:
- Rev:
- Time:
- Project:
- Sheet
- of
- License:
- Copyright © NewAE Technology Inc.
- Approved:
- NewAE.com
- File:

### Library data of the parts
B1-B3 = CCHIP-DNM-0402: DNM, 0402; Case-EIA: 0402; Component Group: Capacitor; Part Number: CCHIP-DNM-0402; Component Kind: Standard; Component Type: Standard; Footprint: 0402; Pin Count: 2; Value: DNM; Mounting Technology: SMT
C13 C15 C17 C19-C22 C28-C40 = CCHIP-100n-0402: 100n, 0402; Case-EIA: 0402; Part Number: CCHIP-100n-0402; Component Kind: Standard; Component Type: Standard; Footprint: 0402; Pin Count: 2; Value: 100n; Mounting Technology: SMT
C14 C16 C18 C23 C24 C41 = CCHIP-2u2-0603: as C1 on sheet mpc56_can; Part Number: CCHIP-2u2-0603; Component Kind: Standard; Component Type: Standard; Footprint: 0603; Pin Count: 2; Value: 2u2; Mounting Technology: SMT
C25-C27 = CCHIP-2u2-0603: 2u2, 0603; Manufacture 1: Samsung; Manufacture Part Number 1: CL10B225KP8NNNC; Component Group: Capacitor; Case-EIA: 0603; Case-Metric: 1608; Rated Voltage: 10VDC; Part Number: CCHIP-2u2-0603; Footprint: 0603; Pin Count: 2; Supplier 1: Digi-Key; Supplier Part Number 1: 1276-1134-2-ND; Value: 2u2; Mounting Technology: SMT; Component Kind: Standard; Component Type: Standard
L1 L2 = FBCHIP-1k-0603: Ferrite Beads HI CUR CHIP BD 0603 1000OHMS 25%; Manufacture 1: Taiyo Yuden; Manufacture Part Number 1: FBMH1608HM102-T / FBMH1608HM102-T / FBMH1608HM102-T / FBMH1608HM102-T; Component Group: Inductor; PP Material Stack: 0; Part Number: FBCHIP-1k-0603; Footprint: 0603; Pin Count: 2; Supplier 1: Mouser; Supplier Part Number 1: 963-FBMH1608HM102-T; Mounting Technology: SMT; RoHS: Yes; Component Kind: Standard; Component Type: Standard; PP Rotation: 0
SJ8 = SJ_2S: Solder Jumper, NC; Part Number: SJ_2S; Component Type: Standard (No BOM); Pin Count: 2
U3 = SPC5676RDK2MVU1R: as U3 on sheet mpc56_clk; Part Number: SPC5676RDK2MVU1R; Manufacture Part Number 1: SPC5676RDK2MVU1R; Pin Count: 412; Supplier 1: Mouser; Mounting Technology: SMT; RoHS: Yes; Component Kind: Standard; Component Type: Standard; PP Rotation: 0

## Nets that join several sheets
GND: mpc56_can (10 pins), mpc56_clk (7 pins), mpc56_cpuio2 (D1.K D2.K), mpc56_cwconn (26 pins), mpc56_mcupower (109 pins)
VCC5V: mpc56_clk (SJ3.3 U3.P2), mpc56_cwconn (C5.1 C6.1 J3.C15 U4.3), mpc56_mcupower (8 pins)
VCCINT_SHUNTLOW: mpc56_cwconn (J3.C2 R17.1), mpc56_mcupower (17 pins)
VCCIO: mpc56_can (6 pins), mpc56_clk (R5.1 R9.2 R10.1), mpc56_cpuio2 (U3.AF4), mpc56_cwconn (J3.A20 J3.B7 J3.C14 R11.2), mpc56_mcupower (49 pins)
BOOTCFG1: mpc56_clk (R6.1 U3.N2), mpc56_cwconn (J3.A17)
CANARX: mpc56_can (U1.4), mpc56_cpuio2 (U3.AE19)
CANATX: mpc56_can (U1.1), mpc56_cpuio2 (U3.AF19)
CANBRX: mpc56_can (U2.4), mpc56_cpuio2 (U3.AC19)
CANBTX: mpc56_can (U2.1), mpc56_cpuio2 (U3.AD19)
CLKIN: mpc56_clk (R7.2), mpc56_cwconn (J3.A3)
CS: mpc56_cpuio2 (U3.L24), mpc56_cwconn (J3.A18)
EVTI: mpc56_clk (R9.1 U3.T4), mpc56_cwconn (J3.B13)
GPIO3: mpc56_cpuio2 (U3.P26), mpc56_cwconn (J3.A9)
GPIO4: mpc56_cpuio2 (U3.N26), mpc56_cwconn (J3.A10)
HDR6: mpc56_cpuio2 (U3.B5), mpc56_cwconn (J3.B16)
JCOMP: mpc56_clk (R10.2 U3.R1), mpc56_cwconn (J3.B11)
LED1: mpc56_clk (R4.2 U3.A3), mpc56_cwconn (J3.C18)
MISO: mpc56_cpuio2 (U3.M23), mpc56_cwconn (J3.A13)
MOSI: mpc56_cpuio2 (U3.L26), mpc56_cwconn (J3.A14)
nRST: mpc56_clk (R5.2 U3.R2), mpc56_cwconn (J3.A11 J3.B8)
SCK: mpc56_cpuio2 (U3.L25), mpc56_cwconn (J3.A12)
TCK: mpc56_clk (U3.AB2), mpc56_cwconn (J3.B6)
TDI: mpc56_clk (U3.AC2), mpc56_cwconn (J3.B3)
TDO: mpc56_clk (U3.AB1), mpc56_cwconn (J3.B4)
TMS: mpc56_clk (U3.AB3), mpc56_cwconn (J3.B5)
UART_RX: mpc56_cpuio2 (U3.M3), mpc56_cwconn (R18.1)
UART_TX: mpc56_cpuio2 (U3.M2), mpc56_cwconn (R12.1)